# Altium schematic sheet Components.SchDoc
size A4; Organization: Machine Intelligence Laboratory; Address1: 1889 Museum Rd; Address2: Room 3001; Address3: Gainesville, FL, 32611; SheetNumber: 4; SheetTotal: 4
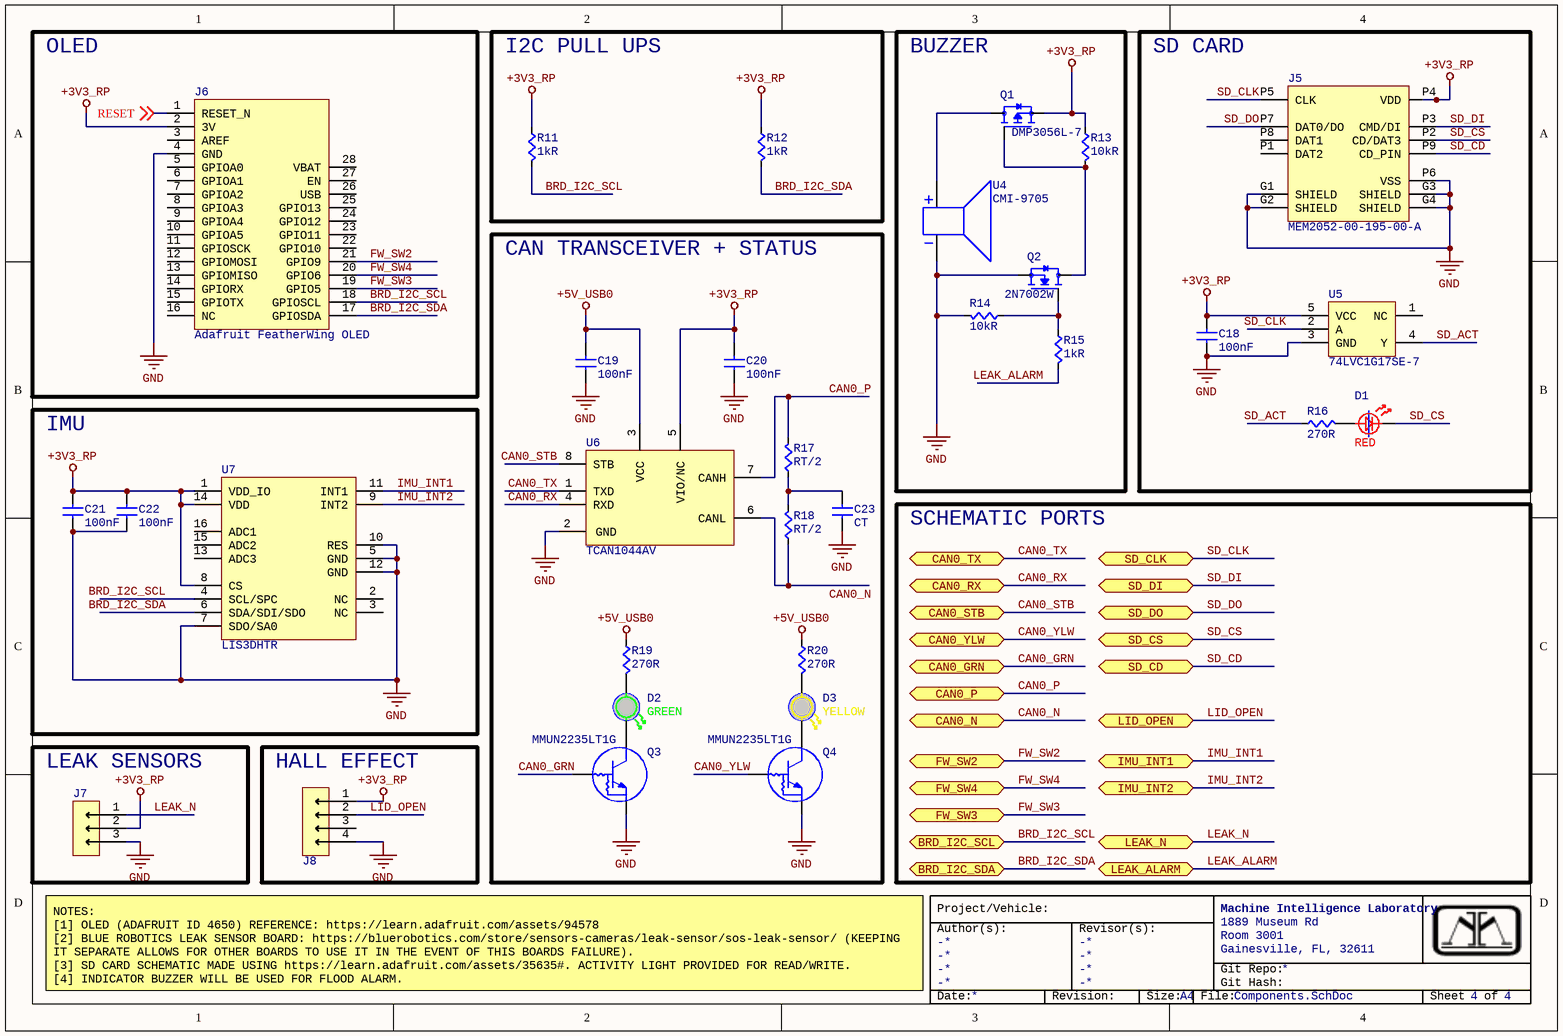
[diagram p0: Components.SchDoc]

## Parts
C18  100nF  [CAPC0603]
C19  100nF  [CAPC0603]
C20  100nF  [CAPC0603]
C21  100nF  [CAPC0603]
C22  100nF  [CAPC0603]
C23  value CT  [CAPC0603]  (hidden comment: Cap)
D1  RED  [LED0603]
D2  GREEN  [LED0603]
D3  YELLOW  [LED0603]
J5  MEM2052-00-195-00-A  [GCT_MEM2052-00-195-00-A_REVA]
J6  Adafruit FeatherWing OLED  [ADAFRUIT_4650]
J7  0353630360  [MOLEX-HDR-1X3-SHERLOCK-RA]  (value not drawn)
J8  0353630460  [MOLEX-HDR-1X4-SHERLOCK-RA]  (value not drawn)
Q1  DMP3056L-7  [SOT-23-3]
Q2  2N7002W  [SOT-323]
Q3  MMUN2235LT1G  [SOT-23-3]
Q4  MMUN2235LT1G  [SOT-23-3]
R11  1kR  [RES0603]
R12  1kR  [RES0603]
R13  10kR  [RES0603]
R14  10kR  [RES0603]
R15  1kR  [RES0603]
R16  270R  [RES0603]
R17  value RT/2  [RES0603]  (hidden comment: Res)
R18  value RT/2  [RES0603]  (hidden comment: Res)
R19  270R  [RES0603]
R20  270R  [RES0603]
U4  CMI-9705  [CUI_CMI-9705-0380-SMT-TR]
U5  74LVC1G17SE-7  [SOT65P210X110-5N]
U6  TCAN1044AV  [SOT65P280X110-8N]
U7  LIS3DHTR  [XDCR_LIS3DHTR]

## Blocks framed on the sheet
OLED: J6
I2C PULL UPS: R11 R12
BUZZER: Q1 Q2 R13-R15 U4
SD CARD: C18 D1 J5 R16 U5
CAN TRANSCEIVER + STATUS: C19 C20 C23 D2 D3 Q3 Q4 R17-R20 U6
IMU: C21 C22 U7
LEAK SENSORS: J7
HALL EFFECT: J8

## Ports
BRD_I2C_SCL (bidir, see Microcontroller[3D]), BRD_I2C_SDA (bidir, see Microcontroller[3D]), CAN0_GRN (bidir, see Connectors[8A], Microcontroller[2D]), CAN0_N (bidir, see Connectors[8A]), CAN0_P (bidir, see Connectors[8A]), CAN0_RX (bidir, see Microcontroller[2C]), CAN0_STB (bidir, see Microcontroller[2C]), CAN0_TX (bidir, see Microcontroller[2C]), CAN0_YLW (bidir, see Connectors[8B], Microcontroller[2C]), FW_SW2 (bidir, see Microcontroller[3C]), FW_SW3 (bidir, see Microcontroller[3C]), FW_SW4 (bidir, see Microcontroller[3C]), IMU_INT1 (bidir, see Microcontroller[3C]), IMU_INT2 (bidir, see Microcontroller[3C]), LEAK_ALARM (bidir, see Microcontroller[3D]), LEAK_N (bidir, see Microcontroller[3D]), LID_OPEN (bidir, see Microcontroller[3D]), SD_CD (bidir, see Microcontroller[3D]), SD_CLK (bidir, see Microcontroller[3C]), SD_CS (bidir, see Microcontroller[3C]), SD_DI (bidir, see Microcontroller[3C]), SD_DO (bidir, see Microcontroller[3C])

## Nets
+3V3_RP: C18.1(A) C20.2(B) C21.2(B) C22.2(B) J5.P4(VDD) J6.2(3V) J7.2 J8.1 Q1.2(S) R11.2(B) R12.2(B) R13.2(B) U5.5(VCC) U6.5(VIO/NC) U7.1(VDD_IO) U7.8(CS) U7.14(VDD)
+5V_USB0: C19.2(B) R19.2(B) R20.2(B) U6.3(VCC)
GND: C18.2(B) C19.1(A) C20.1(A) C21.1(A) C22.1(A) C23.2(B) J5.G1(SHIELD) J5.G2(SHIELD) J5.G3(SHIELD) J5.G4(SHIELD) J5.P6(VSS) J6.4(GND) J7.3 J8.4 Q2.2(S) Q3.2(E) Q4.2(E) R14.1(A) U4.N U5.3(GND) U6.2(GND) U7.5(GND) U7.7(SDO/SA0) U7.10(RES) U7.12(GND)
BRD_I2C_SCL: J6.18(GPIOSCL) R11.1(A) U7.4(SCL/SPC) ; port BRD_I2C_SCL
BRD_I2C_SDA: J6.17(GPIOSDA) R12.1(A) U7.6(SDA/SDI/SDO) ; port BRD_I2C_SDA
CAN0_GRN: Q3.1(B) ; port CAN0_GRN
CAN0_N: R18.2(B) U6.6(CANL) ; port CAN0_N
CAN0_P: R17.1(A) U6.7(CANH) ; port CAN0_P
CAN0_RX: U6.4(RXD) ; port CAN0_RX
CAN0_STB: U6.8(STB) ; port CAN0_STB
CAN0_TX: U6.1(TXD) ; port CAN0_TX
CAN0_YLW: Q4.1(B) ; port CAN0_YLW
FW_SW2: J6.21(GPIO9) ; port FW_SW2
FW_SW3: J6.19(GPIO5) ; port FW_SW3
FW_SW4: J6.20(GPIO6) ; port FW_SW4
IMU_INT1: U7.11(INT1) ; port IMU_INT1
IMU_INT2: U7.9(INT2) ; port IMU_INT2
LEAK_ALARM: R15.1(A) ; port LEAK_ALARM
LEAK_N: J7.1 ; port LEAK_N
LID_OPEN: J8.2 ; port LID_OPEN
RESET: J6.1(RESET_N) ; off-sheet RESET
SD_ACT: R16.2(B) U5.4(Y)
SD_CD: J5.P9(CD_PIN) ; port SD_CD
SD_CLK: J5.P5(CLK) U5.2(A) ; port SD_CLK
SD_CS: D1.C J5.P2(CD/DAT3) ; port SD_CS
SD_DI: J5.P3(CMD/DI) ; port SD_DI
SD_DO: J5.P7(DAT0/DO) ; port SD_DO
NetC23_1: C23.1(A) R17.2(B) R18.1(A)
NetD1_A: D1.A R16.1(A)
NetD2_A: D2.A R19.1(A)
NetD2_C: D2.C Q3.3(C)
NetD3_A: D3.A R20.1(A)
NetD3_C: D3.C Q4.3(C)
NetQ1_1: Q1.1(G) Q2.3(D) R13.1(A)
NetQ1_3: Q1.3(D) U4.P
NetQ2_1: Q2.1(G) R14.2(B) R15.2(B)

Not connected (* = marked no-connect by the designer): J5 P1(DAT2) P8(DAT1); J6 3(AREF) 5(GPIOA0) 6(GPIOA1) 7(GPIOA2) 8(GPIOA3) 9(GPIOA4) 10(GPIOA5) 11(GPIOSCK) 12(GPIOMOSI) 13(GPIOMISO) 14(GPIORX) 15(GPIOTX) 16(NC) 22(GPIO10) 23(GPIO11) 24(GPIO12) 25(GPIO13) 26(USB) 27(EN) 28(VBAT); J8 3; U5 1(NC); U7 2(NC) 3(NC) 13(ADC3) 15(ADC2) 16(ADC1)

## Notes on the sheet
- SCHEMATIC PORTS
- NOTES:
  [1] OLED (ADAFRUIT ID 4650) REFERENCE: https://learn.adafruit.com/assets/94578
  [2] BLUE ROBOTICS LEAK SENSOR BOARD: https://bluerobotics.com/store/sensors-cameras/leak-sensor/sos-leak-sensor/ (KEEPING IT SEPARATE ALLOWS FOR OTHER BOARDS TO USE IT IN THE EVENT OF THIS BOARDS FAILURE).
  [3] SD CARD SCHEMATIC MADE USING https://learn.adafruit.com/assets/35635#. ACTIVITY LIGHT PROVIDED FOR READ/WRITE.
  [4] INDICATOR BUZZER WILL BE USED FOR FLOOD ALARM.
- Project/Vehicle:
- Author(s):
- -
- Revisor(s):
- Git Repo:
- Git Hash:
- Date:
- Revision:
- Size:
- A4
- File:
- Sheet
- of

## Library data of the parts
C18-C22 = CC0603KRX7R7BB104: Ceramic Capacitor, Multilayer, Cera; Manufacturer: Yageo; Multilayer: Yes; Tolerance  (fill in as +-): 10%; Rated DC Voltage (URdc): 16V; Temperature Characteristics Code: X7R; Part Number: CC0603KRX7R7BB104; Category: Ceramic Capacitors; Stock 1: 11347706; Pricing 1: 1=0.1, 10=0.042, 50=0.0238, 100=0.0; Mounting Technology: Surface Mount; Pins: 2; Package Shape: Rectangular; Case/Package: 0603; Terminal Finish: Nickel; Min Operating Temperature: -55°C; Max Operating Temperature: 125°C; JESD-609 Code: e3; Packaging: Tape and Reel; Value: 100nF; Termination: Wraparound; Reach SVHC Compliant: Yes; RoHS Compliant: Yes; ComponentLink1URL: https://datasheet.ciiva.com:443/pdf; ComponentLink1Description: https://datasheet.ciiva.com:443/pdf; ComponentLink2URL: https://datasheet.ciiva.com/11786/0; ComponentLink2Description: https://datasheet.ciiva.com/11786/0; ComponentLink3URL: https://datasheet.ciiva.com/8033/70; ComponentLink3Description: https://datasheet.ciiva.com/8033/70; ComponentLink4URL: https://datasheet.ciiva.com/7978/14; ComponentLink4Description: https://datasheet.ciiva.com/7978/14; ComponentLink5URL: https://datasheet.ciiva.com/28450/1; ComponentLink5Description: https://datasheet.ciiva.com/28450/1; ComponentLink6URL: https://datasheet.ciiva.com/46430/1; ComponentLink6Description: https://datasheet.ciiva.com/46430/1; ComponentLink7URL: https://datasheet.ciiva.com/144/mlc; ComponentLink7Description: https://datasheet.ciiva.com/144/mlc; ComponentLink8URL: https://datasheet.ciiva.com/144/mlc; ComponentLink8Description: https://datasheet.ciiva.com/144/mlc; ComponentLink9URL: https://datasheet.ciiva.com/144/mlc; ComponentLink9Description: https://datasheet.ciiva.com/144/mlc; Supplier Part Number 1: 311-1088-1-ND; Manufacturer Part Number: CC0603KRX7R7BB104; RoHS: Yes; Package Style: SMTMeter; Supplier 1: Digikey; Dielectric Material: Ceramic; Capacitor Type: Ceramic; Tolerance (fill in as +-): 10%; Length: 1.6mm; Width: 0.8mm; Height: 0.8mm; ComponentLink10URL: https://datasheet.ciiva.com/8033/17; ComponentLink10Description: https://datasheet.ciiva.com/8033/17; ComponentLink11URL: https://datasheet.ciiva.com/13395/u; ComponentLink11Description: https://datasheet.ciiva.com/13395/u; ComponentLink12URL: https://datasheet.ciiva.com/11464/u; ComponentLink12Description: https://datasheet.ciiva.com/11464/u; ComponentLink13URL: https://datasheet.ciiva.com/15165/g; ComponentLink13Description: https://datasheet.ciiva.com/15165/g; ComponentLink14URL: https://datasheet.ciiva.com:443/pdfs/VipMasterIC/IC/YAGO/YAGO-S-A0003557223; ComponentLink14Description: https://datasheet.ciiva.com:443/pdfs/VipMasterIC/IC/YAGO/YAGO-S-A0003557223; ComponentLink15URL: https://datasheet.ciiva.com/11786/0900766b80d84f1d-11786077.pdf?src-supplie; ComponentLink15Description: https://datasheet.ciiva.com/11786/0900766b80d84f1d-11786077.pdf?src-supplie; ComponentLink16URL: https://datasheet.ciiva.com/8033/70765-8033799.pdf?src-supplier=Element14; ComponentLink16Description: https://datasheet.ciiva.com/8033/70765-8033799.pdf?src-supplier=Element14; ComponentLink17URL: https://datasheet.ciiva.com/7978/1489800-7978141.pdf?src-supplier=Element14; ComponentLink17Description: https://datasheet.ciiva.com/7978/1489800-7978141.pdf?src-supplier=Element14; ComponentLink18URL: https://datasheet.ciiva.com/28450/1489800-28450552.pdf?src-supplier=Element
D1 = 150060RS75000: Single Color LED, Red, Water Clear,; Manufacturer: Wurth Electronics; Shape: Rectangular; Forward Current: 30mA; Luminous Intensity-Nom: 250mcd; Channels: 1; Viewing Angle: 140°; Overall Height: 0.7mm; Part Number: 150060RS75000; Category: LEDs; Stock 1: 139850; Pricing 1: 1=0.15, 50=0.142, 100=0.122, 500=0.; Mounting Technology: Surface Mount; Pins: 2; Min Operating Temperature: -40°C; Max Operating Temperature: 85°C; Packaging: Tape and Reel; Reach SVHC Compliant: Yes; RoHS Compliant: Yes; ComponentLink1URL: https://datasheet.ciiva.com:443/pdf; ComponentLink1Description: https://datasheet.ciiva.com:443/pdf; ComponentLink2URL: https://datasheet.ciiva.com/29563/1; ComponentLink2Description: https://datasheet.ciiva.com/29563/1; ComponentLink3URL: https://datasheet.ciiva.com/29279/7; ComponentLink3Description: https://datasheet.ciiva.com/29279/7; Supplier Part Number 1: 732-4978-1-ND; Manufacturer Part Number: 150060RS75000; RoHS: Yes; Supplier 1: Digikey; Color: Red; Lens Style: WATER CLEAR; Optoelectronic Device Type: SINGLE COLOR LED; Size: 1.1mm; Terminal Pitch: 1.6mm
D2 = 150060VS75000: Single Color LED, Bright Green, Wat; Manufacturer: Wurth Electronics; Shape: Rectangular; Lens Style: WATER CLEAR; Forward Current: 30mA; Luminous Intensity-Nom: 40mcd; Channels: 1; Viewing Angle: 140°; Overall Height: 0.7mm; Part Number: 150060VS75000; Category: LEDs; Stock 1: 38675; Pricing 1: 1=0.15, 50=0.142, 100=0.122, 500=0.; Mounting Technology: Surface Mount; Pins: 2; Min Operating Temperature: -40°C; Max Operating Temperature: 85°C; Packaging: Tape and Reel; Reach SVHC Compliant: Yes; RoHS Compliant: Yes; ComponentLink1URL: https://datasheet.ciiva.com:443/pdf; ComponentLink1Description: https://datasheet.ciiva.com:443/pdf; ComponentLink2URL: https://datasheet.ciiva.com/29562/1; ComponentLink2Description: https://datasheet.ciiva.com/29562/1; Supplier Part Number 1: 732-4980-1-ND; Manufacturer Part Number: 150060VS75000; RoHS: Yes; Supplier 1: Digikey; Color: Green; Optoelectronic Device Type: SINGLE COLOR LED; Size: 1.1mm; Terminal Pitch: 1.6mm
D3 = 150060YS75000: Single Color LED, Yellow, Water Cle; Manufacturer: Wurth Electronics; Shape: Rectangular; Lens Style: WATER CLEAR; Forward Current: 30mA; Luminous Intensity-Nom: 120mcd; Channels: 1; Viewing Angle: 140°; Overall Height: 0.7mm; Part Number: 150060YS75000; Category: LEDs; Stock 1: 50357; Pricing 1: 1=0.15, 50=0.142, 100=0.122, 500=0.; Mounting Technology: Surface Mount; Pins: 2; Min Operating Temperature: -40°C; Max Operating Temperature: 85°C; Packaging: Tape and Reel; Reach SVHC Compliant: Yes; RoHS Compliant: Yes; ComponentLink1URL: https://datasheet.ciiva.com:443/pdf; ComponentLink1Description: https://datasheet.ciiva.com:443/pdf; ComponentLink2URL: https://datasheet.ciiva.com/23843/1; ComponentLink2Description: https://datasheet.ciiva.com/23843/1; ComponentLink3URL: https://datasheet.ciiva.com/29279/7; ComponentLink3Description: https://datasheet.ciiva.com/29279/7; ComponentLink4URL: https://datasheet.ciiva.com/22656/1; ComponentLink4Description: https://datasheet.ciiva.com/22656/1; ComponentLink5URL: https://datasheet.ciiva.com/29563/1; ComponentLink5Description: https://datasheet.ciiva.com/29563/1; ComponentLink6URL: https://datasheet.ciiva.com/29563/1; ComponentLink6Description: https://datasheet.ciiva.com/29563/1; ComponentLink7URL: https://datasheet.ciiva.com/48430/1; ComponentLink7Description: https://datasheet.ciiva.com/48430/1; Supplier Part Number 1: 732-4981-1-ND; Manufacturer Part Number: 150060YS75000; RoHS: Yes; Supplier 1: Digikey; Color: Yellow; Optoelectronic Device Type: SINGLE COLOR LED; Size: 1.1mm; Terminal Pitch: 1.6mm
J5 = MEM2052-00-195-00-A: 9 (8 + 1) Position Card Connector Secure Digital - microSD™ Surface Mount, Right Angle Gold
J6 = ADAFRUIT_4650: Adafruit FeatherWing OLED - 128x64 OLED Add-on For Feather - STEMMA QT / Qwiic; Supplier 1: Digikey; Supplier Part Number 1: 1528-4650-ND
J7 = SHERLOCK-1x3-RA: Header, Molex, 2mm Pitch Sherlock Header, Single Row, Right Angle 3 Circuits, Length 3.3mm; Manufacturer Part Number: 35363-0360; Manufacturer: Molex Connector Corporation; Supplier Part Number 1: WM18932-ND; Supplier 1: Digi-Key
J8 = SHERLOCK-1x4-RA: Header, Molex, 2mm Pitch Sherlock Header, Single Row, Horizontal, 4 Circuits, Length 3.3mm; Manufacturer Part Number: 0353630460; Supplier Part Number 1: WM18933-ND; Manufacturer: Molex; Supplier 1: Digikey
Q1 = DMP3056L-7: Power Field-Effect Transistor, 4.3A; Manufacturer: Diodes; Package Body Material: Plastic; Transistor Element Material: SILICON; Polarity/Channel Type: P-CHANNEL; Part Number: DMP3056L-7; Category: MOSFETs; Stock 1: 150897; Pricing 1: 1=0.41, 10=0.315, 100=0.189, 500=0.; Pins: 3; Package Shape: Rectangular; Terminal Finish: Tin; JESD-609 Code: e3; Supplier Part Number 1: DMP3056L-7DICT-ND; Manufacturer Part Number: DMP3056L-7; RoHS: Yes; Supplier 1: Digikey
Q2 = 2N7002W: Small Signal Field-Effect Transisto; Manufacturer: ON Semiconductor / Fairchild; Package Body Material: Plastic; Transistor Element Material: SILICON; Polarity/Channel Type: N-CHANNEL; Number of Elements: 1; Power Dissipation-Max (Abs): 200mW; Transistor Application: SWITCHING; Drain Current-Max (Abs) (ID): 115mA; Drain-source On Resistance-Max: 7.5R; DS Breakdown Voltage-Min: 60V; FET Technology: METAL-OXIDE SEMICONDUCTOR; Operating Mode: ENHANCEMENT MODE; Part Number: 2N7002W; Category: MOSFETs; Stock 1: 71945; Pricing 1: 1=0.43, 10=0.302, 100=0.1524, 500=0; Pins: 3; Package Shape: Rectangular; Max Operating Temperature: 150°C; Supplier Part Number 1: 2N7002WCT-ND; Manufacturer Part Number: 2N7002W; RoHS: Yes; Package Style: SMALL OUTLINEMeter; Supplier 1: Digikey; Moisture Sensitivity Level: 1; JESD-30 Code: R-PDSO-G3; Surface Mount: Yes; Terminal Form: Gull Wing; Terminal Position: DUAL; Drain Current-Max (ID): 115mA
Q3 Q4 = MMUN2235LT1G: Small Signal Bipolar Transistor, 0.; Manufacturer: ON Semiconductor; Package Body Material: Plastic; Transistor Element Material: SILICON; Polarity/Channel Type: NPN; Max Collector Current: 100mA; Collector-emitter Voltage-Max: 50V; DC Current Gain-Min (hFE): 80; Number of Elements: 1; Power Dissipation-Max (Abs): 400mW; Transistor Application: SWITCHING; JEDEC-95 Code: TO-236AB; Part Number: MMUN2235LT1G; Category: BJTs; Stock 1: 373000; Pricing 1: 1=0.1198, 10=0.0829, 100=0.035, 100; Pins: 3; Package Shape: Rectangular; Terminal Finish: Tin; JESD-609 Code: e3; Reach SVHC Compliant: Yes; RoHS Compliant: Yes; ComponentLink1URL: https://datasheet.ciiva.com:443/pdf; ComponentLink1Description: https://datasheet.ciiva.com:443/pdf; ComponentLink2URL: http://www.mouser.com/ds/2/308/DTC1; ComponentLink2Description: http://www.mouser.com/ds/2/308/DTC1; ComponentLink3URL: http://www.onsemi.com/pub/Collatera; ComponentLink3Description: http://www.onsemi.com/pub/Collatera; ComponentLink4URL: http://www.onsemi.com/pub/Collatera; ComponentLink4Description: http://www.onsemi.com/pub/Collatera; Supplier Part Number 1: MMUN2235LT1G; Manufacturer Part Number: MMUN2235LT1G; RoHS: Yes; Package Style: SMALL OUTLINEMeter; Supplier 1: Arrow Electronics; Moisture Sensitivity Level: 1; JESD-30 Code: R-PDSO-G3; Surface Mount: Yes; Terminal Form: Gull Wing; Terminal Position: DUAL
R11 R12 R15 = RC0603FR-071KL: Fixed Resistor, Metal Glaze/thick F; Manufacturer: Yageo; Power: 100mW; Rated Temperature: 70°C; Tolerance: 1%; Additional Feature: LASER TRIMMABLE; Temperature Coefficient: 100ppm/°C; Working Voltage: 75V; Package Height: 0.45mm; Package Length: 1.6mm; Package Width: 0.8mm; Part Number: RC0603FR-071KL; Category: Chip SMD Resistors; Stock 1: 11540000; Pricing 1: 5000=0.0015, 50000=0.0014, 150000=0; Mounting Technology: Surface Mount; Pins: 2; Package Shape: Rectangular; Case/Package: 0603; Terminal Finish: Nickel; Min Operating Temperature: -55°C; Max Operating Temperature: 155°C; JESD-609 Code: e3; Resistor Type: FIXED RESISTOR; Packaging: Tape and Reel; Value: 1kR; Termination: Wraparound; Technology: METAL GLAZE/THICK FILM; Reach SVHC Compliant: Yes; RoHS Compliant: Yes; ComponentLink1URL: https://datasheet.ciiva.com:443/pdf; ComponentLink1Description: https://datasheet.ciiva.com:443/pdf; ComponentLink2URL: https://datasheet.ciiva.com/11808/0; ComponentLink2Description: https://datasheet.ciiva.com/11808/0; ComponentLink3URL: https://datasheet.ciiva.com/7746/16; ComponentLink3Description: https://datasheet.ciiva.com/7746/16; ComponentLink4URL: https://datasheet.ciiva.com/7660/18; ComponentLink4Description: https://datasheet.ciiva.com/7660/18; ComponentLink5URL: https://datasheet.ciiva.com/7983/44; ComponentLink5Description: https://datasheet.ciiva.com/7983/44; ComponentLink6URL: https://datasheet.ciiva.com/7746/17; ComponentLink6Description: https://datasheet.ciiva.com/7746/17; ComponentLink7URL: https://datasheet.ciiva.com/7746/17; ComponentLink7Description: https://datasheet.ciiva.com/7746/17; ComponentLink8URL: https://datasheet.ciiva.com/8896/py; ComponentLink8Description: https://datasheet.ciiva.com/8896/py; ComponentLink9URL: https://datasheet.ciiva.com/15189/g; ComponentLink9Description: https://datasheet.ciiva.com/15189/g; Supplier Part Number 1: 4016291; Manufacturer Part Number: RC0603FR-071KL; RoHS: Yes; Construction: Chip; Package Style: SMTMeter
R13 R14 = RC0603FR-0710KL: Fixed Resistor, Metal Glaze/thick F; Manufacturer: Yageo; Power: 100mW; Rated Temperature: 70°C; Tolerance: 1%; Additional Feature: LASER TRIMMABLE; Temperature Coefficient: 100ppm/°C; Working Voltage: 75V; Package Height: 0.45mm; Package Length: 1.6mm; Package Width: 0.8mm; Part Number: RC0603FR-0710KL; Category: Chip SMD Resistors; Stock 1: 20315897; Pricing 1: 1=0.1, 10=0.019, 50=0.0112, 100=0.0; Mounting Technology: Surface Mount; Pins: 2; Package Shape: Rectangular; Case/Package: 0603; Terminal Finish: Nickel; Min Operating Temperature: -55°C; Max Operating Temperature: 155°C; JESD-609 Code: e3; Resistor Type: FIXED RESISTOR; Packaging: Tape and Reel; Value: 10kR; Termination: Wraparound; Technology: METAL GLAZE/THICK FILM; Reach SVHC Compliant: Yes; RoHS Compliant: Yes; ComponentLink1URL: https://datasheet.ciiva.com:443/pdf; ComponentLink1Description: https://datasheet.ciiva.com:443/pdf; ComponentLink2URL: https://datasheet.ciiva.com/15189/g; ComponentLink2Description: https://datasheet.ciiva.com/15189/g; ComponentLink3URL: https://datasheet.ciiva.com/7660/38; ComponentLink3Description: https://datasheet.ciiva.com/7660/38; ComponentLink4URL: https://datasheet.ciiva.com/46440/1; ComponentLink4Description: https://datasheet.ciiva.com/46440/1; ComponentLink5URL: https://datasheet.ciiva.com/7746/17; ComponentLink5Description: https://datasheet.ciiva.com/7746/17; ComponentLink6URL: https://datasheet.ciiva.com/7983/44; ComponentLink6Description: https://datasheet.ciiva.com/7983/44; ComponentLink7URL: https://datasheet.ciiva.com/22747/4; ComponentLink7Description: https://datasheet.ciiva.com/22747/4; Supplier Part Number 1: 311-10.0KHRCT-ND; Manufacturer Part Number: RC0603FR-0710KL; RoHS: Yes; Construction: Chip; Package Style: SMTMeter; Supplier 1: Digikey
R16 R19 R20 = RC0603FR-07270RL: Fixed Resistor, Metal Glaze/thick F; Manufacturer: Yageo; Power: 100mW; Rated Temperature: 70°C; Tolerance: 1%; Additional Feature: LASER TRIMMABLE; Temperature Coefficient: 100ppm/°C; Working Voltage: 75V; Package Height: 0.45mm; Package Length: 1.6mm; Package Width: 0.8mm; Part Number: RC0603FR-07270RL; Category: Chip SMD Resistors; Stock 1: 855000; Pricing 1: 5000=0.0015, 50000=0.0014, 150000=0; Mounting Technology: Surface Mount; Pins: 2; Package Shape: Rectangular; Case/Package: 0603; Terminal Finish: Nickel; Min Operating Temperature: -55°C; Max Operating Temperature: 155°C; JESD-609 Code: e3; Resistor Type: FIXED RESISTOR; Packaging: Tape and Reel; Value: 270R; Termination: Wraparound; Technology: METAL GLAZE/THICK FILM; Reach SVHC Compliant: Yes; RoHS Compliant: Yes; ComponentLink1URL: https://datasheet.ciiva.com:443/pdf; ComponentLink1Description: https://datasheet.ciiva.com:443/pdf; ComponentLink2URL: https://datasheet.ciiva.com/11808/0; ComponentLink2Description: https://datasheet.ciiva.com/11808/0; ComponentLink3URL: https://datasheet.ciiva.com/2455/py; ComponentLink3Description: https://datasheet.ciiva.com/2455/py; ComponentLink4URL: https://datasheet.ciiva.com/2455/py; ComponentLink4Description: https://datasheet.ciiva.com/2455/py; ComponentLink5URL: https://datasheet.ciiva.com/2455/py; ComponentLink5Description: https://datasheet.ciiva.com/2455/py; ComponentLink6URL: https://datasheet.ciiva.com/15189/g; ComponentLink6Description: https://datasheet.ciiva.com/15189/g; ComponentLink7URL: https://datasheet.ciiva.com/7746/44; ComponentLink7Description: https://datasheet.ciiva.com/7746/44; ComponentLink8URL: https://datasheet.ciiva.com/7746/44; ComponentLink8Description: https://datasheet.ciiva.com/7746/44; Supplier Part Number 1: 7559610; Manufacturer Part Number: RC0603FR-07270RL; RoHS: Yes; Construction: Chip; Package Style: SMTMeter; Supplier 1: Future Electronics
U4 = CMI-9705-0380-SMT-TR: Buzzers Indicator, Internally Driven Magnetic 3 V 30mA 2.7kHz 80dB @ 3V, 10cm Surface Mount Solder Pads
U5 = 74LVC1G17SE-7: Buffer, Non-Inverting 1 Element 1 Bit per Element Push-Pull Output SOT-353
U6 = TCAN1044AVDDFRQ1: 1/1 Transceiver Half CANbus TSOT-23-8; Supplier 1: Digikey; Supplier Part Number 1: 296-TCAN1057ADDFRQ1CT-ND
U7 = LIS3DHTR: Accelerometer X, Y, Z Axis ±2g, 4g, 8g, 16g 0.5Hz ~ 625Hz 16-LGA (3x3); Supplier 1: Digikey; Supplier Part Number 1: 497-10613-1-ND
C23 = Cap: Supplier 1: Digi-Key; Supplier Part Number 1: 1276-1000-1-ND
R17 R18 = Res: Supplier 1: Digi-Key; Supplier Part Number 1: RMCF0603JT10K0CT-ND